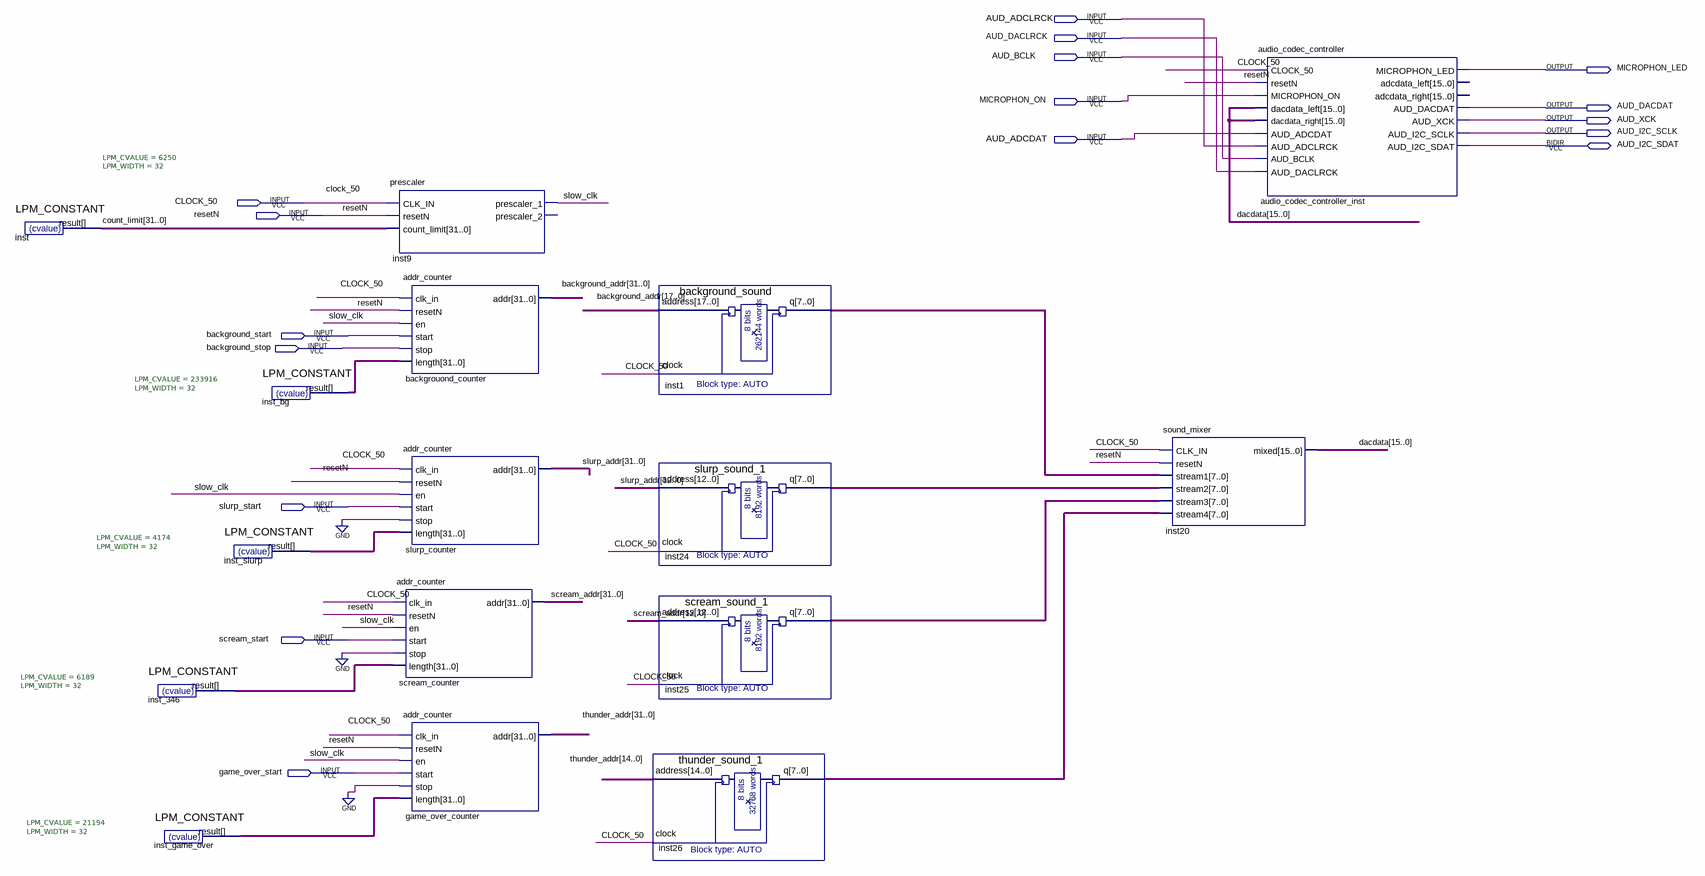
[diagram p0: schematic sheet]
// Quartus schematic sounds_top.bdf as structural Verilog: 16 symbols, 17 pins
module sounds_top (
  input  AUD_ADCLRCK,
  input  AUD_DACLRCK,
  input  AUD_BCLK,
  input  MICROPHON_ON,
  input  AUD_ADCDAT,
  input  CLOCK_50,
  input  resetN,
  input  background_start,
  input  background_stop,
  input  slurp_start,
  input  scream_start,
  input  game_over_start,
  inout  AUD_I2C_SDAT,
  output MICROPHON_LED,
  output AUD_DACDAT,
  output AUD_XCK,
  output AUD_I2C_SCLK
);

  wire slow_clk;
  wire [7:0] inst1_q, inst24_q, inst25_q, inst26_q;
  wire [15:0] dacdata;
  wire [31:0] background_addr, count_limit, inst_346_result, inst_bg_result, inst_game_over_result,
       inst_slurp_result, scream_addr, slurp_addr, thunder_addr;

  LPM_CONSTANT #(.LPM_CVALUE(6250), .LPM_WIDTH(32)) inst (.result(count_limit));
  LPM_CONSTANT #(.LPM_CVALUE(6189), .LPM_WIDTH(32)) inst_346 (.result(inst_346_result));
  LPM_CONSTANT #(.LPM_CVALUE(21194), .LPM_WIDTH(32)) inst_game_over (.result(inst_game_over_result));
  LPM_CONSTANT #(.LPM_CVALUE(4174), .LPM_WIDTH(32)) inst_slurp (.result(inst_slurp_result));
  LPM_CONSTANT #(.LPM_CVALUE(233916), .LPM_WIDTH(32)) inst_bg (.result(inst_bg_result));
  prescaler inst9 (
    .CLK_IN(CLOCK_50), .resetN(resetN), .count_limit(count_limit), .prescaler_1(slow_clk));  // open: prescaler_2
  addr_counter backgrouond_counter (
    .clk_in(CLOCK_50), .resetN(resetN), .en(slow_clk), .start(background_start), .stop(background_stop),
    .length(inst_bg_result), .addr(background_addr));
  addr_counter slurp_counter (
    .clk_in(CLOCK_50), .resetN(resetN), .en(slow_clk), .start(slurp_start), .stop(1'b0),
    .length(inst_slurp_result), .addr(slurp_addr));
  addr_counter scream_counter (
    .clk_in(CLOCK_50), .resetN(resetN), .en(slow_clk), .start(scream_start), .stop(1'b0),
    .length(inst_346_result), .addr(scream_addr));
  addr_counter game_over_counter (
    .clk_in(CLOCK_50), .resetN(resetN), .en(slow_clk), .start(game_over_start), .stop(1'b0),
    .length(inst_game_over_result), .addr(thunder_addr));
  background_sound inst1 (.address(background_addr[17:0]), .clock(CLOCK_50), .q(inst1_q));
  slurp_sound_1 inst24 (.address(slurp_addr[12:0]), .clock(CLOCK_50), .q(inst24_q));
  scream_sound_1 inst25 (.address(scream_addr[12:0]), .clock(CLOCK_50), .q(inst25_q));
  thunder_sound_1 inst26 (.address(thunder_addr[14:0]), .clock(CLOCK_50), .q(inst26_q));
  sound_mixer inst20 (
    .CLK_IN(CLOCK_50), .resetN(resetN), .stream1(inst1_q), .stream2(inst24_q), .stream3(inst25_q),
    .stream4(inst26_q), .mixed(dacdata));
  audio_codec_controller audio_codec_controller_inst (
    .CLOCK_50(CLOCK_50), .resetN(resetN), .MICROPHON_ON(MICROPHON_ON), .dacdata_left(dacdata),
    .dacdata_right(dacdata), .AUD_ADCDAT(AUD_ADCDAT), .AUD_ADCLRCK(AUD_ADCLRCK), .AUD_BCLK(AUD_BCLK),
    .AUD_DACLRCK(AUD_DACLRCK), .MICROPHON_LED(MICROPHON_LED), .AUD_DACDAT(AUD_DACDAT), .AUD_XCK(AUD_XCK),
    .AUD_I2C_SCLK(AUD_I2C_SCLK), .AUD_I2C_SDAT(AUD_I2C_SDAT));  // open: adcdata_left, adcdata_right
endmodule
